# EAGLE design DragonBreakout (EAGLE 9.6.2)
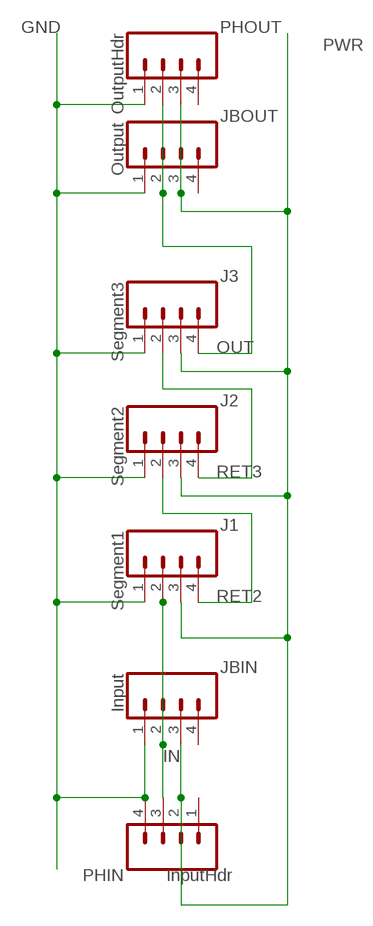
[diagram p0: schematic, sheet 1]

## Parts
J1  Segment1  CONN_04SCREW_LOCK  [SCREWTERMINAL-3.5MM-4_LOCK]
J2  Segment2  CONN_04SCREW_LOCK  [SCREWTERMINAL-3.5MM-4_LOCK]
J3  Segment3  CONN_04SCREW_LOCK  [SCREWTERMINAL-3.5MM-4_LOCK]
JBIN  Input  CONN_04SCREW_LOCK  [SCREWTERMINAL-3.5MM-4_LOCK]
JBOUT  Output  CONN_04SCREW_LOCK  [SCREWTERMINAL-3.5MM-4_LOCK]
PHIN  InputHdr  CONN_04PTH  [1X04]
PHOUT  OutputHdr  CONN_04PTH  [1X04]

## Nets
GND: J1.1 J2.1 J3.1 JBIN.1 JBOUT.1 PHIN.4 PHOUT.1
IN: J1.2 JBIN.2 PHIN.3
OUT: J3.4 JBOUT.2 PHOUT.2
PWR: J1.3 J2.3 J3.3 JBIN.3 JBOUT.3 PHIN.2 PHOUT.3
RET2: J1.4 J2.2
RET3: J2.4 J3.2
Unconnected: JBIN.4 JBOUT.4 PHIN.1 PHOUT.4

## Library data of the parts
J1-J3 JBIN JBOUT = SparkFun-Connectors:CONN_04: Multi connection point. Often used as Generic Header-pin footprint for 0.1 inch spaced/style header connections On any of the 0.1 inch spaced packages, you can populate with these: Break Away Headers - Straight <https://www.sparkfun.com/products/116> (PRT-00116) Break Away Male Headers - Right Angle <https://www.sparkfun.com/products/553> (PRT-00553) Female Headers <https://www.sparkfun.com/products/115> (PRT-00115) Break Away Headers - Machine Pin <https://www.sparkfun.com/products/117> (PRT-00117) Break Away Female Headers - Swiss Machine Pin <https://www.sparkfun.com/products/743> (PRT-00743) For SCREWTERMINALS and SPRING TERMINALS visit here: Screw Terimnals on SparkFun.com <https://www.sparkfun.com/search/results?term=Screw+Terminals> (5mm/3.5mm/2.54mm spacing) This device is also useful as a general connection point to wire up your design to another part of your project. Our various solder wires solder well into these plated through hole pads. Hook-Up Wire - Assortment (Stranded, 22 AWG) <https://www.sparkfun.com/products/11375> (PRT-11375) Hook-Up Wire - Assortment (Solid Core, 22 AWG) <https://www.sparkfun.com/products/11367> (PRT-11367) View the entire wire category on our website here <https://www.sparkfun.com/categories/141> Special notes: Molex polarized connector foot print use with SKU : PRT-08231 with associated crimp pins and housings. 1MM SMD Version SKU: PRT-10208
PHIN PHOUT = SparkFun-Connectors:CONN_04: Multi connection point. Often used as Generic Header-pin footprint for 0.1 inch spaced/style header connections On any of the 0.1 inch spaced packages, you can populate with these: Break Away Headers - Straight <https://www.sparkfun.com/products/116> (PRT-00116) Break Away Male Headers - Right Angle <https://www.sparkfun.com/products/553> (PRT-00553) Female Headers <https://www.sparkfun.com/products/115> (PRT-00115) Break Away Headers - Machine Pin <https://www.sparkfun.com/products/117> (PRT-00117) Break Away Female Headers - Swiss Machine Pin <https://www.sparkfun.com/products/743> (PRT-00743) For SCREWTERMINALS and SPRING TERMINALS visit here: Screw Terimnals on SparkFun.com <https://www.sparkfun.com/search/results?term=Screw+Terminals> (5mm/3.5mm/2.54mm spacing) This device is also useful as a general connection point to wire up your design to another part of your project. Our various solder wires solder well into these plated through hole pads. Hook-Up Wire - Assortment (Stranded, 22 AWG) <https://www.sparkfun.com/products/11375> (PRT-11375) Hook-Up Wire - Assortment (Solid Core, 22 AWG) <https://www.sparkfun.com/products/11367> (PRT-11367) View the entire wire category on our website here <https://www.sparkfun.com/categories/141> Special notes: Molex polarized connector foot print use with SKU : PRT-08231 with associated crimp pins and housings. 1MM SMD Version SKU: PRT-10208; PROD_ID: CONN-09696

## Board
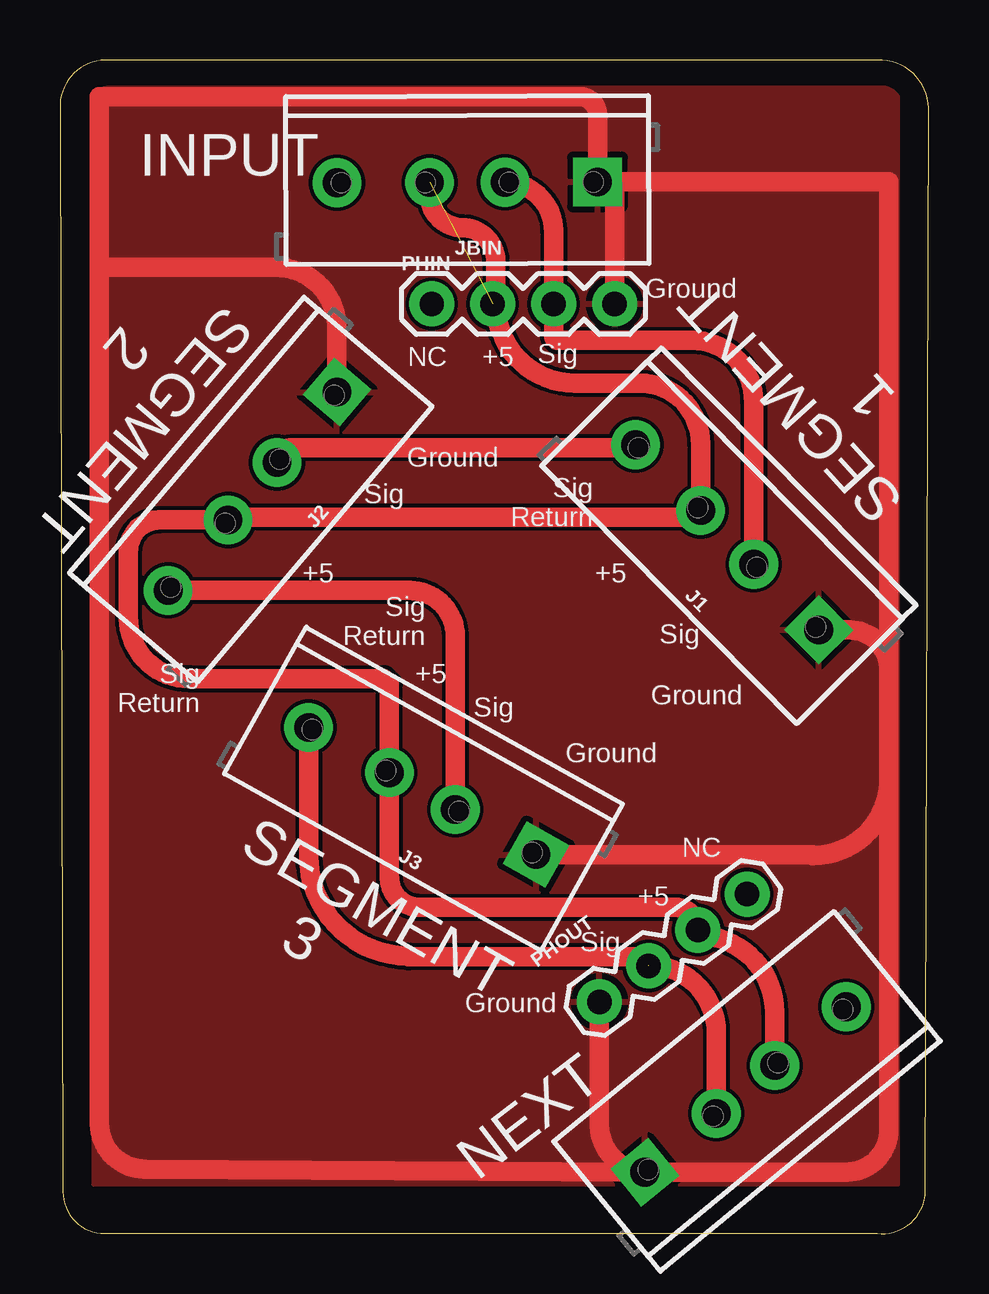
[diagram p1: board, top side]
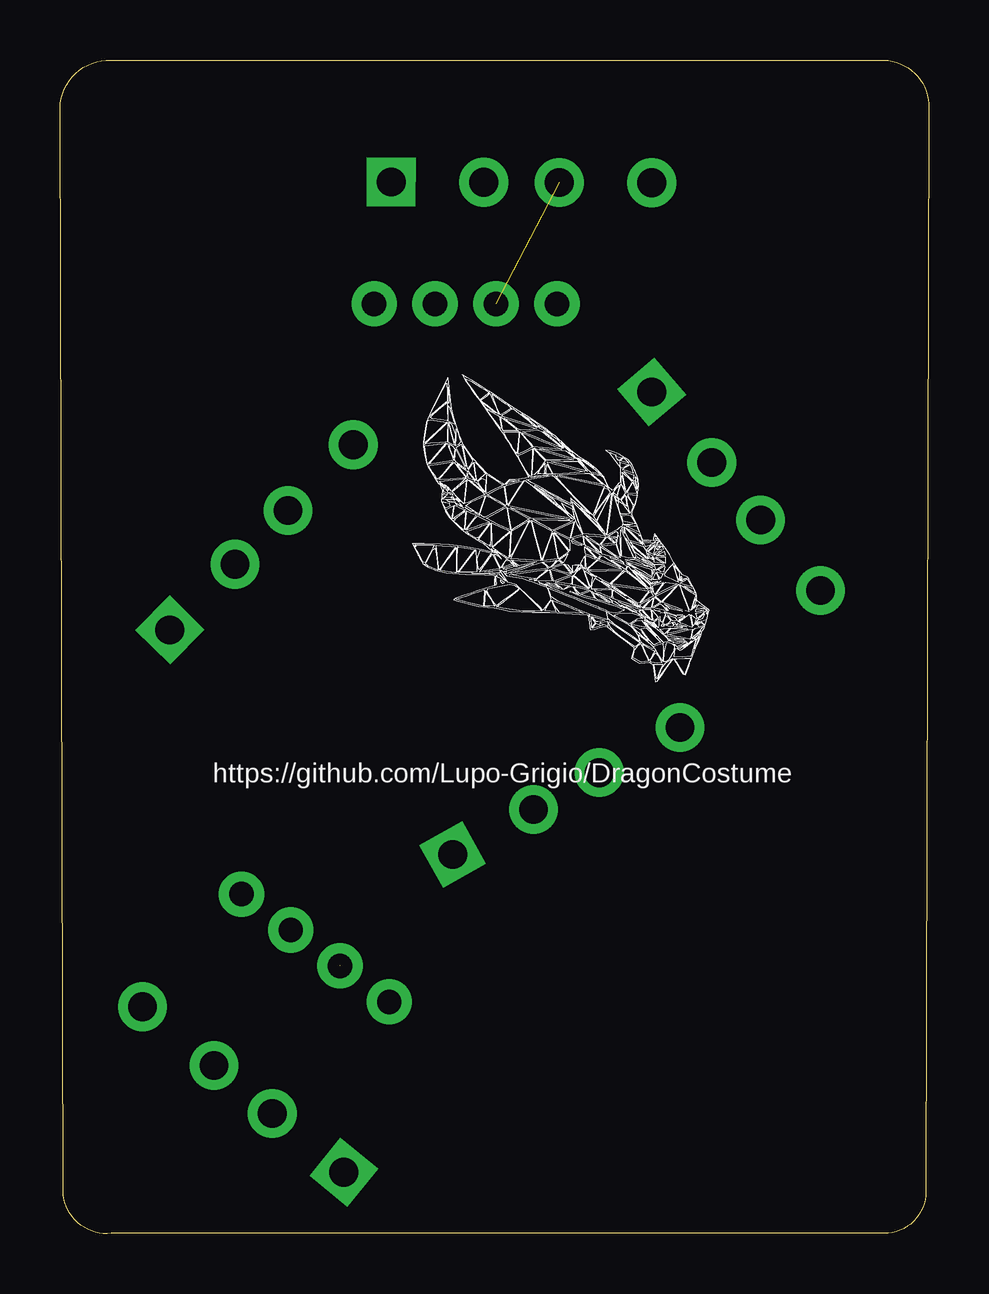
[diagram p2: board, bottom side, seen from below]

Size 36.19 x 48.9 mm. Coordinates in mm from the lower left corner, seen from the top.
Outline: 0,46.9 0.12,1.75 arc90 1.86,0.01 34.06,0.01 arc90 36.06,1.63 36.19,46.91 arc90 34.07,48.9 1.87,48.9 arc90 0,46.9
Copper layers (1*16): Top 0.035mm / dielectric 1.5mm / Bottom 0.035mm
Design rules "default": minimum track width 6mil, minimum drill 0.35mm, track to track 6mil, track to pad 6mil, pad to pad 6mil, via to via 6mil, smd to smd 6mil, copper to edge 40mil, drill to drill 6mil, minimum pad ring 10mil, minimum via ring 8mil, stop-mask expansion 4mil, vias tented up to drill 0mil, thermal gap 10mil

### Footprints (pad centres in the part's own frame; a part is rotated, then mirrored left to right if it is on the bottom)
SCREWTERMINAL-3.5MM-4_LOCK = drill 1.2 pad 2.032 square: 1 -0.178,0 | drill 1.2 pad 2.032: 2 3.678,0; 3 6.822,0; 4 10.678,0
1X04 = drill 1.016 pad 1.88: 1 0,0; 2 2.54,0; 3 5.08,0; 4 7.62,0

### Placement (x,y rotation side)
J1  31.49,25.28 134.7 top
J2  11.42,34.93 229.6 top
J3  19.68,15.88 150.8 top
JBIN  22.22,43.82 180.2 top
JBOUT  24.51,2.68 39.4 top
PHIN  15.49,38.74 0 top
PHOUT  22.47,9.66 36.1 top

### Tracks (layer width: path | path; a pad name or v marks a point on that pad's centre or on a via)
GND
  Top 0.813: JBOUT.1 3.54,2.69 arc-90 1.65,4.58 1.65,40.27 | PHOUT.1 22.47,4.68 arc90 JBOUT.1 | 34.54,23.51 arc90 32.89,25.16 J1.1 | 34.54,18.93 34.54,23.51 | 34.54,18.93 arc-90 31.36,15.76 arc90 31.32,15.8 J3.1 | 34.54,38.36 34.54,43.83 JBIN.1 22.4,46.62 arc90 21.64,47.38 1.65,47.38 1.65,40.27 | 34.54,23.51 34.54,43.82 23.11,43.82 PHIN.4 | J2.1 11.54,37.73 arc90 9,40.27 1.65,40.27 | JBOUT.1 32.76,2.56 | 32.76,2.56 arc90 34.54,4.34 | 32.76,2.56 arc90 34.54,4.34 | 34.54,4.34 34.54,18.93
  pour Top: 34.92,47.51 arc90 34.67,47.76 2.03,47.76 arc90 1.39,47.13 1.39,2.04 34.92,2.04
IN
  Top 0.813: JBIN.2 arc-90 20.57,41.78 PHIN.3 20.57,37.35 arc-90 20.7,37.22 26.36,37.22 arc-90 28.9,34.68 J1.2
OUT  (1 unrouted)
  Top 0.813: J3.4 10.36,15.76 arc90 14.55,11.57 14.52,11.54 24.14,11.54 PHOUT.2 | 24.53,11.19 arc-90 27.35,8.36 JBOUT.2
PWR  (1 unrouted)
  Top 0.813: JBOUT.3 29.78,9.23 arc90 26.58,12.42 PHOUT.3 arc90 25.63,13.6 14.98,13.6 arc-90 13.72,14.85 J3.3 13.72,22.9 13.5,23.12 5.39,23.12 arc-90 2.85,25.66 2.85,28.46 arc-90 4.13,29.74 J2.3 7.12,29.85 26.41,29.85 arc90 J1.3 26.69,32.9 arc90 24.15,35.44 21.46,35.44 arc-90 18.16,38.74 18.16,40.52 arc90 16.76,41.92 arc-90 15.4,43.28 JBIN.3
RET2
  Top 0.813: J1.4 23.85,32.75 9.65,32.75 arc90 J2.2
RET3
  Top 0.813: J2.4 14.56,26.8 arc-90 16.47,24.9 J3.2

### Text on the board
tPlace: INPUT | SEGMENT / 2 | Ground | NC | +5 | Sig | Ground | SEGMENT / 1 | Sig / Return | Sig | +5 | +5 | Sig / Return | Sig | Sig / Return | +5 | Sig | Ground | Ground | NC | +5 | SEGMENT / 3 | Sig | Ground | NEXT
bPlace: https://github.com/Lupo-Grigio/DragonCostume